# Altium project _Freelance_Pirate_Puzzle.PrjPcb
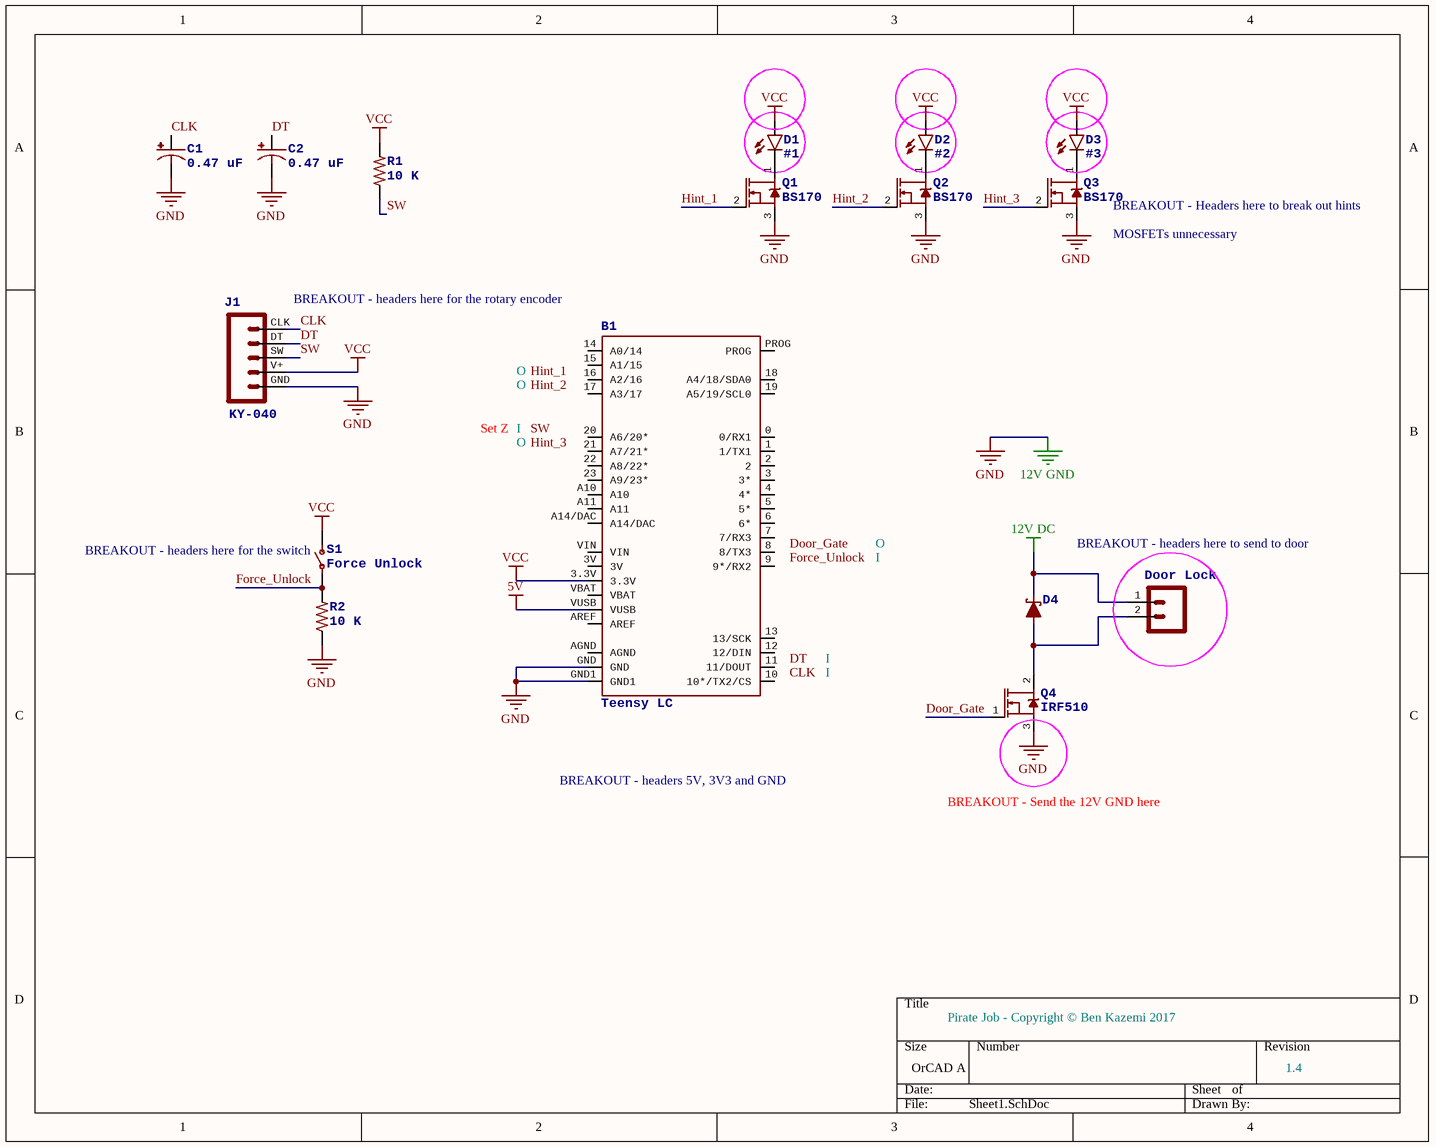
[diagram p0: Sheet1.SchDoc]
1 sheet, 16 parts. Net scope: global (net labels, ports and power ports of the same name join across sheets).
Board file: PCB1.PcbDoc

## Sheet Sheet1.SchDoc
size OrCAD A; Author: Ben Kazemi; DocumentName: Freelance

### Parts
B1  Teensy LC  [TEENSY-3.1]
C1  0.47 uF  [PANASONIC_D]
C2  0.47 uF  [PANASONIC_D]
D1  #1  [LED_5MM]
D2  #2  [LED_5MM]
D3  #3  [LED_5MM]
D4  (no value)  [SOD-323]
Door_Lock  (no value)  [1X02_LOCK]
J1  KY-040  [1X05]
Q1  BS170  [TO-92]
Q2  BS170  [TO-92]
Q3  BS170  [TO-92]
Q4  IRF510  [TO220V]
R1  10 K  [AXIAL-0.3]
R2  10 K  [AXIAL-0.3]
S1  Force Unlock  [SWITCH-SPST-VERTICAL]

### Nets
5V: B1.VUSB
12V DC: D4.C Door_Lock.1
12V GND: B1.GND B1.GND1 C1.- C2.- J1.GND Q1.3(S) Q2.3(S) Q3.3(S) Q4.3(S) R2.P$1  [also labelled GND]
VCC: B1.3.3V D1.A D2.A D3.A J1.V+ R1.P$2 S1.1(O)
CLK: C1.+ J1.CLK
Door_Gate: Q4.1(G)
DT: C2.+ J1.DT
Force_Unlock: R2.P$2 S1.2(P)
Hint_1: Q1.2(G)
Hint_2: Q2.2(G)
Hint_3: Q3.2(G)
SW: J1.SW R1.P$1
NetD1_K: D1.K(C) Q1.1(D)
NetD2_K: D2.K(C) Q2.1(D)
NetD3_K: D3.K(C) Q3.1(D)
NetD4_A: D4.A Door_Lock.2 Q4.2(D)

Not connected (* = marked no-connect by the designer): B1 0(0/RX1) 1(1/TX1) 2 3(3*) 3V 4(4*) 5(5*) 6(6*) 7(7/RX3) 8(8/TX3) 9(9*/RX2) 10(10*/TX2/CS) 11(11/DOUT) 12(12/DIN) 13(13/SCK) 14(A0/14) 15(A1/15) 16(A2/16) 17(A3/17) 18(A4/18/SDA0) 19(A5/19/SCL0) 20(A6/20*) 21(A7/21*) 22(A8/22*) 23(A9/23*) A10 A11 A14/DAC AGND AREF PROG VBAT VIN

### Notes on the sheet
- (near Q3) BREAKOUT - Headers here to break out hints
- BREAKOUT - headers here for the rotary encoder
- (near Q3) MOSFETs unnecessary
- O
- Set Z
- I
- (near S1) BREAKOUT - headers here for the switch
- BREAKOUT - headers here to send to door
- BREAKOUT - headers 5V, 3V3 and GND
- BREAKOUT - Send the 12V GND here
- Pirate Job - Copyright © Ben Kazemi 2017
- 1.4
- Labels drawn without touching a wire or pin: CLK, Door_Gate, DT, Force_Unlock, Hint_1, Hint_2, Hint_3, SW

### Library data of the parts
B1 = TEENSY-3.1SILK: SF_ID: DEV-12646
C1 C2 = 47UF-POLAR-PANASONIC_D-50V-20%
D1-D3 = LED5MM
D4 = DIODE-SCHOTTKY-BAT20J: Schottky diode    A Schottky diode is a semiconductor diode which has a low forward voltage drop and a very fast switching action.; PROD_ID: DIO-11623
Door_Lock = CONN_02LOCK
J1 = CONN_05: Rotary Encoder
Q1-Q4 = MOSFET-NCH-FQP30N06L: PROD_ID: TRANS-10060
R1 R2 = 10KOHM-HORIZ-1/4W-5%: PROD_ID: RES-09435
S1 = SWITCH-SPST-2TV